# Altium schematic sheet PhaseDetector.SchDoc
size 193 x 146 mm; DocumentNumber: 2; SheetNumber: 2; SheetTotal: 11
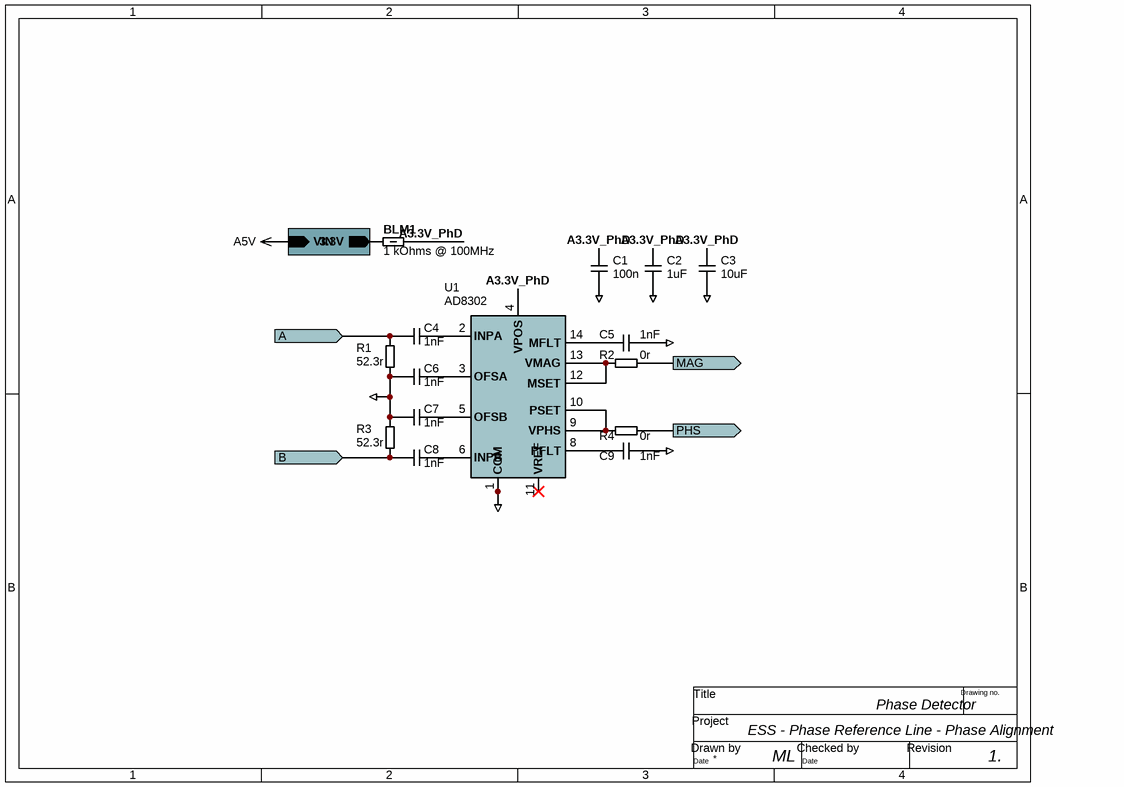
[diagram p0: PhaseDetector.SchDoc]

## Parts
BLM1  1 kOhms @ 100MHz  [0402-Inductor]
C1  100n  [0402-Capacitor]
C2  1uF  [0603-Capacitor]
C3  10uF  [1206-capacitor]
C4  1nF  [0603-Capacitor]
C5  1nF  [0603-Capacitor]
C6  1nF  [0603-Capacitor]
C7  1nF  [0603-Capacitor]
C8  1nF  [0603-Capacitor]
C9  1nF  [0603-Capacitor]
R1  52.3r  [0603-RESISTOR]
R2  0r  [0603-RESISTOR]
R3  52.3r  [0603-RESISTOR]
R4  0r  [0603-RESISTOR]
U1  AD8302  [TSSOP14]

## Sub-sheets
A3.3V_PhD = LDO3v3.SchDoc: 3.3V (out), VIN (in)

## Ports
A (in), B (in), MAG (out), PHS (out)

## Nets
A5V: sheet A3.3V_PhD/VIN
GND: C1.1 C2.1 C3.1 C5.2 C6.1 C7.1 C9.2 R1.1 R3.2 U1.1(COM) U1.7(COM)
A: C4.1 R1.2 ; port A
A3.3V_PhD: BLM1.2 C1.2 C2.2 C3.2 U1.4(VPOS)
B: C8.1 R3.1 ; port B
MAG: R2.1 ; port MAG
PHS: R4.1 ; port PHS
NetBLM1_1: BLM1.1 ; sheet A3.3V_PhD/3.3V
NetC4_2: C4.2 U1.2(INPA)
NetC5_1: C5.1 U1.14(MFLT)
NetC6_2: C6.2 U1.3(OFSA)
NetC7_2: C7.2 U1.5(OFSB)
NetC8_2: C8.2 U1.6(INPB)
NetC9_1: C9.1 U1.8(PFLT)
NetR2_2: R2.2 U1.12(MSET) U1.13(VMAG)
NetR4_2: R4.2 U1.9(VPHS) U1.10(PSET)

Not connected (* = marked no-connect by the designer): U1 11(VREF)*

## Notes on the sheet
- ESS - Phase Reference Line - Phase Alignment
- Phase Detector
- ML
- 1.
- Title
- Project
- Drawing no.
- Date
- Drawn by
- Checked by
- Revision

## Library data of the parts
BLM1 = BLM15AG102SZ1D: 1 kOhms @ 100MHz 1 Signal Line Ferrite Bead 0402 (1005 Metric) 300mA 650mOhm; Case: 0402; Supplier 1: Digi-Key; Supplier Part Number 1: 490-16511-1-ND; HelpURL: https://www.murata.com/en-us/products/productdata/8796748677150/QNFA9118.pdf
C1 = C_0402: Capacitor 0402; Tolerance: ±20%; Voltage Rating: 16V; Dielectric: X7R/C0G; Value: 100n; Case: 0402
C2 C4-C9 = C_0603: Capacitor 0603; Tolerance: ±20%; Voltage Rating: 16V; Dielectric: X7R/C0G; Case: 0603
  C2: Value: 1uF
  C4-C9: Value: 1nF
C3 = C_1206: Capacitor 1206; Voltage Rating: 16V; Tolerance: ±20%; Dielectric: X7R/C0G; Value: 10uF; Case: 1206
R1-R4 = R_0603: Resistor 0603; Tolerance: ±1%; Case: 0603
  R1 R3: Value: 52.3r
  R2 R4: Value: 0r
U1 = AD8302: RF/IF Gain and Phase Detector / • LF–2.7 GHz /; HelpURL: https://www.analog.com/media/en/technical-documentation/data-sheets/ad8302.pdf; Supplier 1: Farnell; Supplier Part Number 1: 1498702; Case: TSSOP14